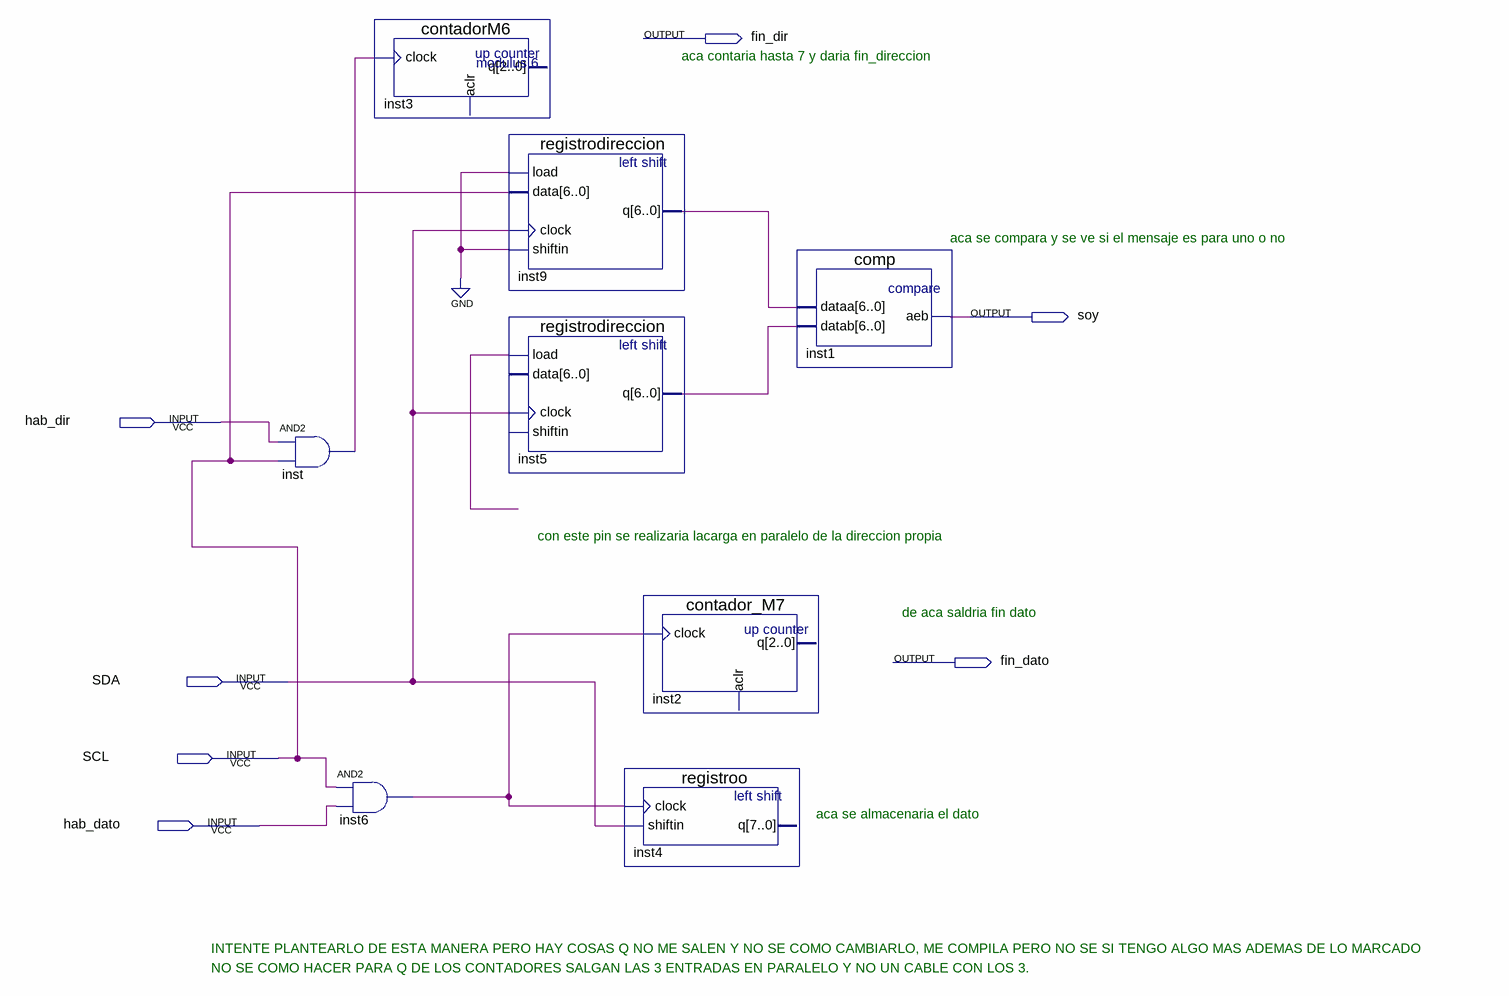
[diagram p0: schematic sheet]
// Quartus schematic Block1.bdf as structural Verilog: 8 symbols, 7 pins
module Block1 (
  input  hab_dir,
  input  SDA,
  input  SCL,
  input  hab_dato,
  output fin_dir,
  output soy,
  output fin_dato
);

  wire inst6_out, inst_out, undriven;
  wire [6:0] inst5_q, inst9_q;

  and inst (inst_out, hab_dir, SCL);
  and inst6 (inst6_out, SCL, hab_dato);
  contadorM6 inst3 (.clock(inst_out));  // open: aclr, q
  registrodireccion inst9 (.load(1'b0), .data({7{SCL}}), .clock(SDA), .shiftin(1'b0), .q(inst9_q));
  registrodireccion inst5 (.load(undriven), .clock(SDA), .q(inst5_q));  // open: data, shiftin
  contador_M7 inst2 (.clock(inst6_out));  // open: aclr, q
  registroo inst4 (.clock(inst6_out), .shiftin(SDA));  // open: q
  comp inst1 (.dataa(inst9_q), .datab(inst5_q), .aeb(soy));

  // Notes on the sheet:
  //   aca contaria hasta 7 y daria fin_direccion
  //   aca se compara y se ve si el mensaje es para uno o no
  //   con este pin se realizaria lacarga en paralelo de la direccion propia
  //   de aca saldria fin dato
  //   aca se almacenaria el dato
  //   INTENTE PLANTEARLO DE ESTA MANERA PERO HAY COSAS Q NO ME SALEN Y NO SE COMO CAMBIARLO, ME COMPILA PERO NO SE SI TENGO ALGO MAS ADEMAS DE LO MARCADO
  //   NO SE COMO HACER PARA Q DE LOS CONTADORES SALGAN LAS 3 ENTRADAS EN PARALELO Y NO UN CABLE CON LOS 3.
endmodule
